# EAGLE design 0 (EAGLE 7.6.0)
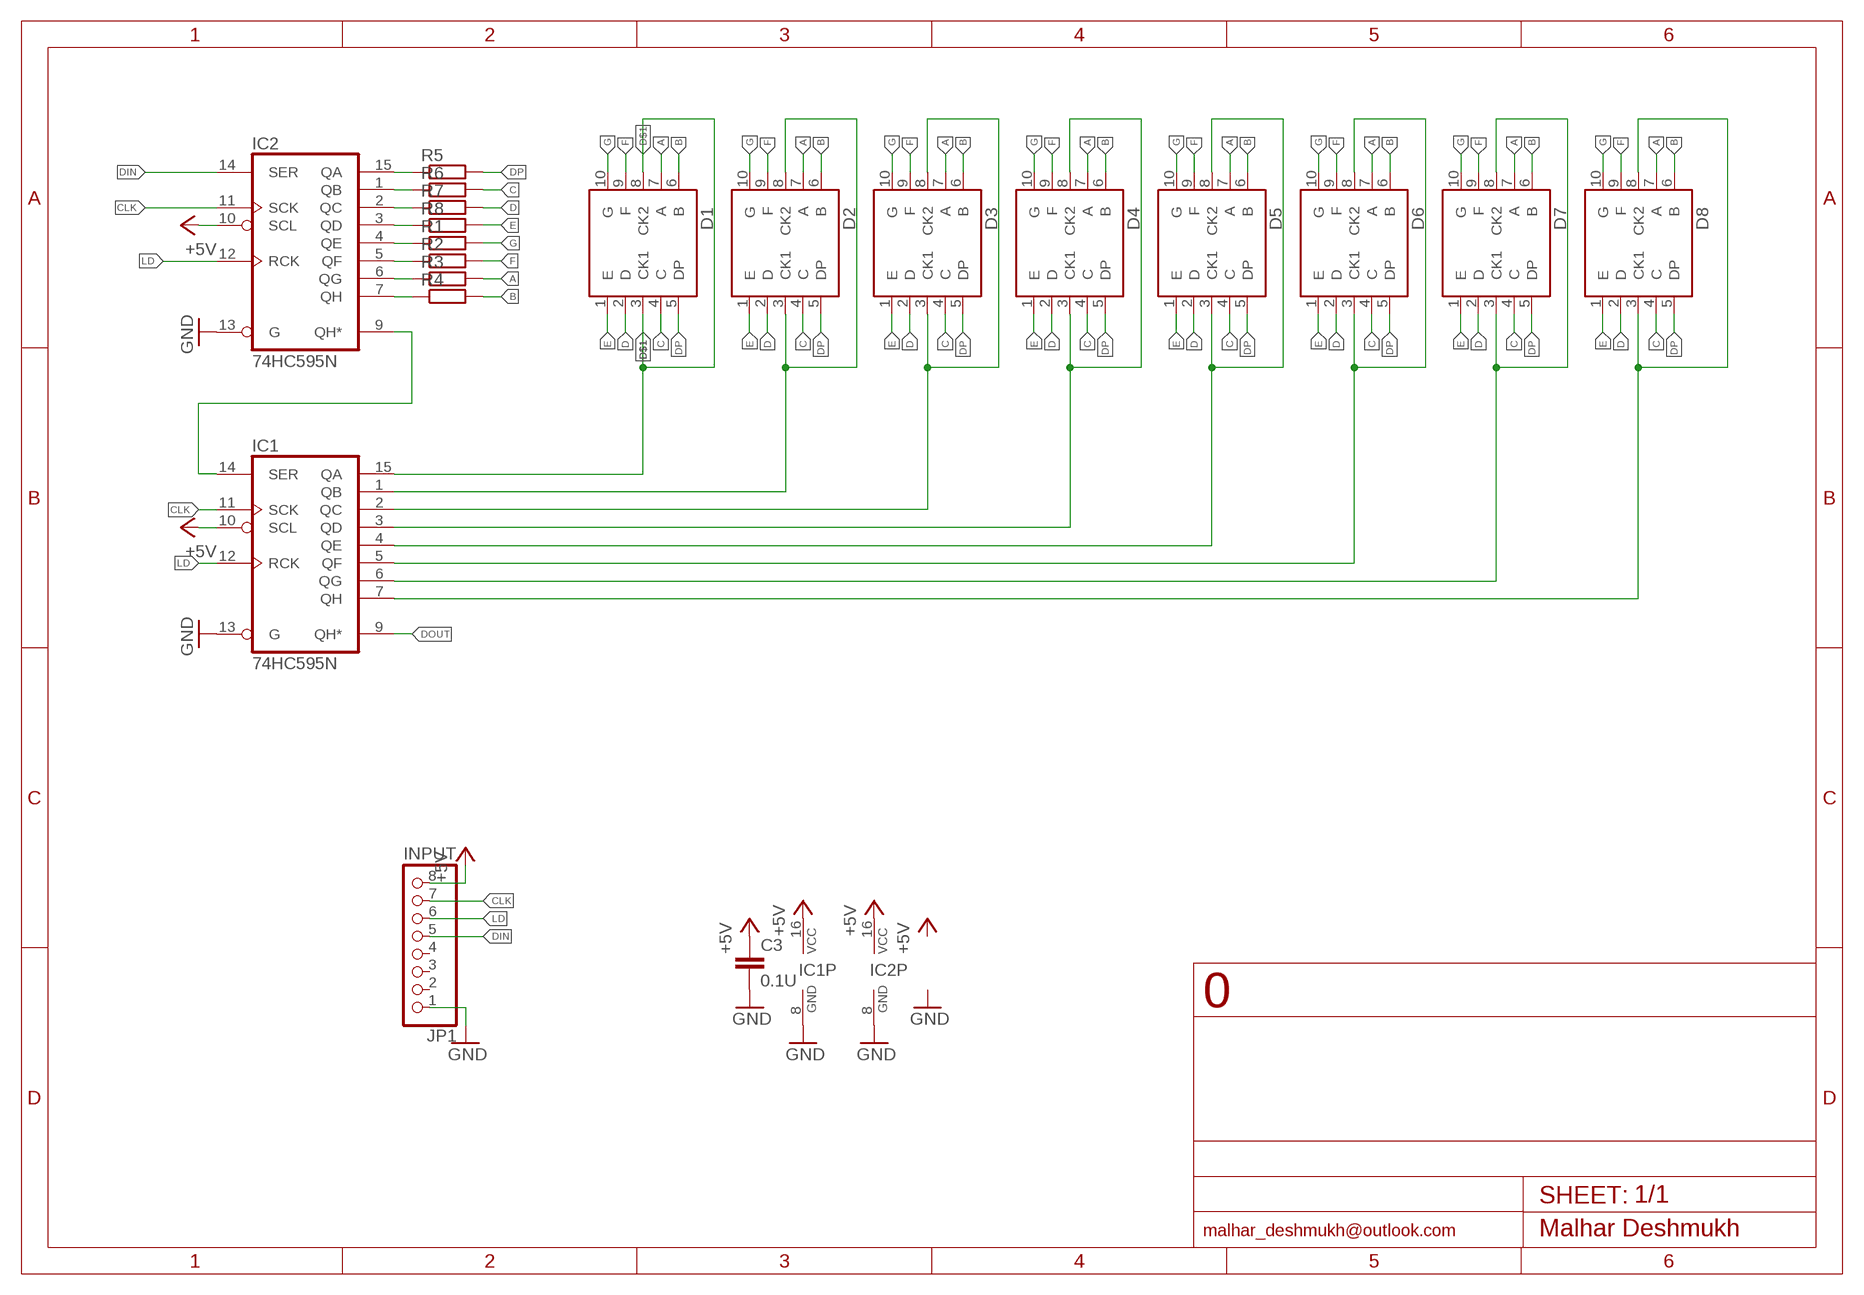
[diagram p0: schematic, sheet 1]

## Parts
C3  0.1U  C-EU050-024X044  [C050-024X044]
D1  7SEG-CK  [7SEG-13]
D2  7SEG-CK  [7SEG-13]
D3  7SEG-CK  [7SEG-13]
D4  7SEG-CK  [7SEG-13]
D5  7SEG-CK  [7SEG-13]
D6  7SEG-CK  [7SEG-13]
D7  7SEG-CK  [7SEG-13]
D8  7SEG-CK  [7SEG-13]
IC1  74HC595N  [DIL16]
IC2  74HC595N  [DIL16]
JP1  INPUT  PINHD-1X8  [1X08]
R1  R-EU_0207/7  [0207/7]
R2  R-EU_0207/7  [0207/7]
R3  R-EU_0207/7  [0207/7]
R4  R-EU_0207/7  [0207/7]
R5  R-EU_0207/7  [0207/7]
R6  R-EU_0207/7  [0207/7]
R7  R-EU_0207/7  [0207/7]
R8  R-EU_0207/7  [0207/7]

## Nets
+5V: C3.1 IC1.10(SCL) IC1.16(VCC) IC2.10(SCL) IC2.16(VCC) JP1.8
A: D1.7(A) D2.7(A) D3.7(A) D4.7(A) D5.7(A) D6.7(A) D7.7(A) D8.7(A) R3.2
B: D1.6(B) D2.6(B) D3.6(B) D4.6(B) D5.6(B) D6.6(B) D7.6(B) D8.6(B) R4.2
C: D1.4(C) D2.4(C) D3.4(C) D4.4(C) D5.4(C) D6.4(C) D7.4(C) D8.4(C) R6.2
CLK: IC1.11(SCK) IC2.11(SCK) JP1.7
D: D1.2(D) D2.2(D) D3.2(D) D4.2(D) D5.2(D) D6.2(D) D7.2(D) D8.2(D) R7.2
D$1: D1.3(CK1) D1.8(CK2) IC1.15(QA)
DIN: IC2.14(SER) JP1.5
DOUT: IC1.9(QH*)
DP: D1.5(DP) D2.5(DP) D3.5(DP) D4.5(DP) D5.5(DP) D6.5(DP) D7.5(DP) D8.5(DP) R5.2
E: D1.1(E) D2.1(E) D3.1(E) D4.1(E) D5.1(E) D6.1(E) D7.1(E) D8.1(E) R8.2
F: D1.9(F) D2.9(F) D3.9(F) D4.9(F) D5.9(F) D6.9(F) D7.9(F) D8.9(F) R2.2
G: D1.10(G) D2.10(G) D3.10(G) D4.10(G) D5.10(G) D6.10(G) D7.10(G) D8.10(G) R1.2
GND: C3.2 IC1.8(GND) IC1.13(G) IC2.8(GND) IC2.13(G) JP1.1
LD: IC1.12(RCK) IC2.12(RCK) JP1.6
N$1: IC2.15(QA) R5.1
N$2: IC2.1(QB) R6.1
N$3: IC2.2(QC) R7.1
N$4: IC2.3(QD) R8.1
N$5: IC2.4(QE) R1.1
N$6: IC2.5(QF) R2.1
N$7: IC2.6(QG) R3.1
N$8: IC2.7(QH) R4.1
N$9: IC1.14(SER) IC2.9(QH*)
N$10: D2.3(CK1) D2.8(CK2) IC1.1(QB)
N$12: D3.3(CK1) D3.8(CK2) IC1.2(QC)
N$13: D5.3(CK1) D5.8(CK2) IC1.4(QE)
N$14: D6.3(CK1) D6.8(CK2) IC1.5(QF)
N$15: D7.3(CK1) D7.8(CK2) IC1.6(QG)
N$16: D8.3(CK1) D8.8(CK2) IC1.7(QH)
N$21: D4.3(CK1) D4.8(CK2) IC1.3(QD)
Unconnected: JP1.2 JP1.3 JP1.4

## Library data of the parts
C3 = CustomLib:C-EU: CAPACITOR, European symbol
D1-D8 = CustomLib:7SEG-CK: 7-segment DISPLAY single cathode, 13 mm
IC1 IC2 = 74xx-eu:74*595: 8-bit SHIFT REGISTER, output latch
JP1 = pinhead:PINHD-1X8: PIN HEADER
R1-R8 = CustomLib:R-EU_: RESISTOR, European symbol

## Board
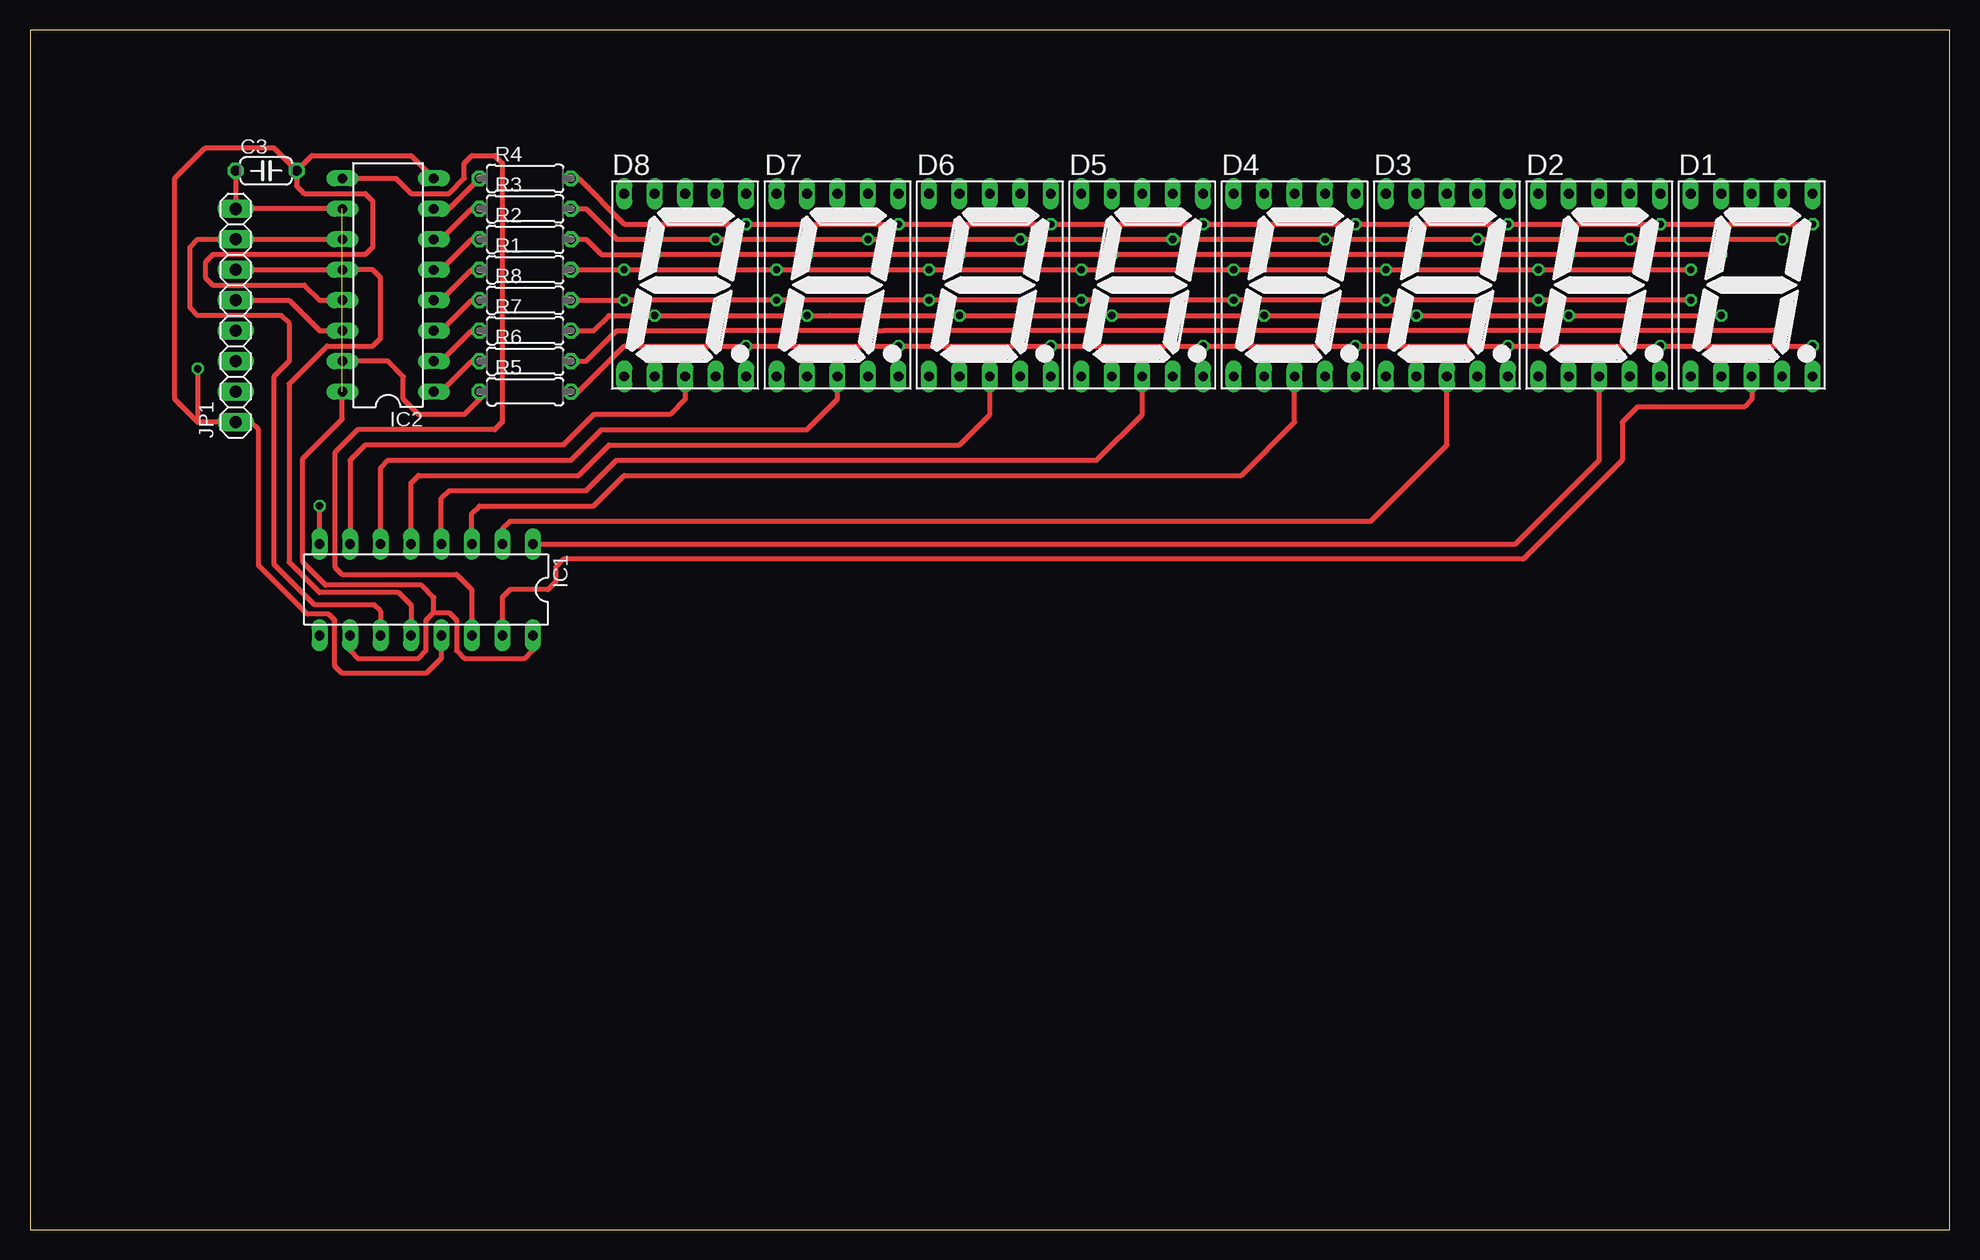
[diagram p1: board, top side]
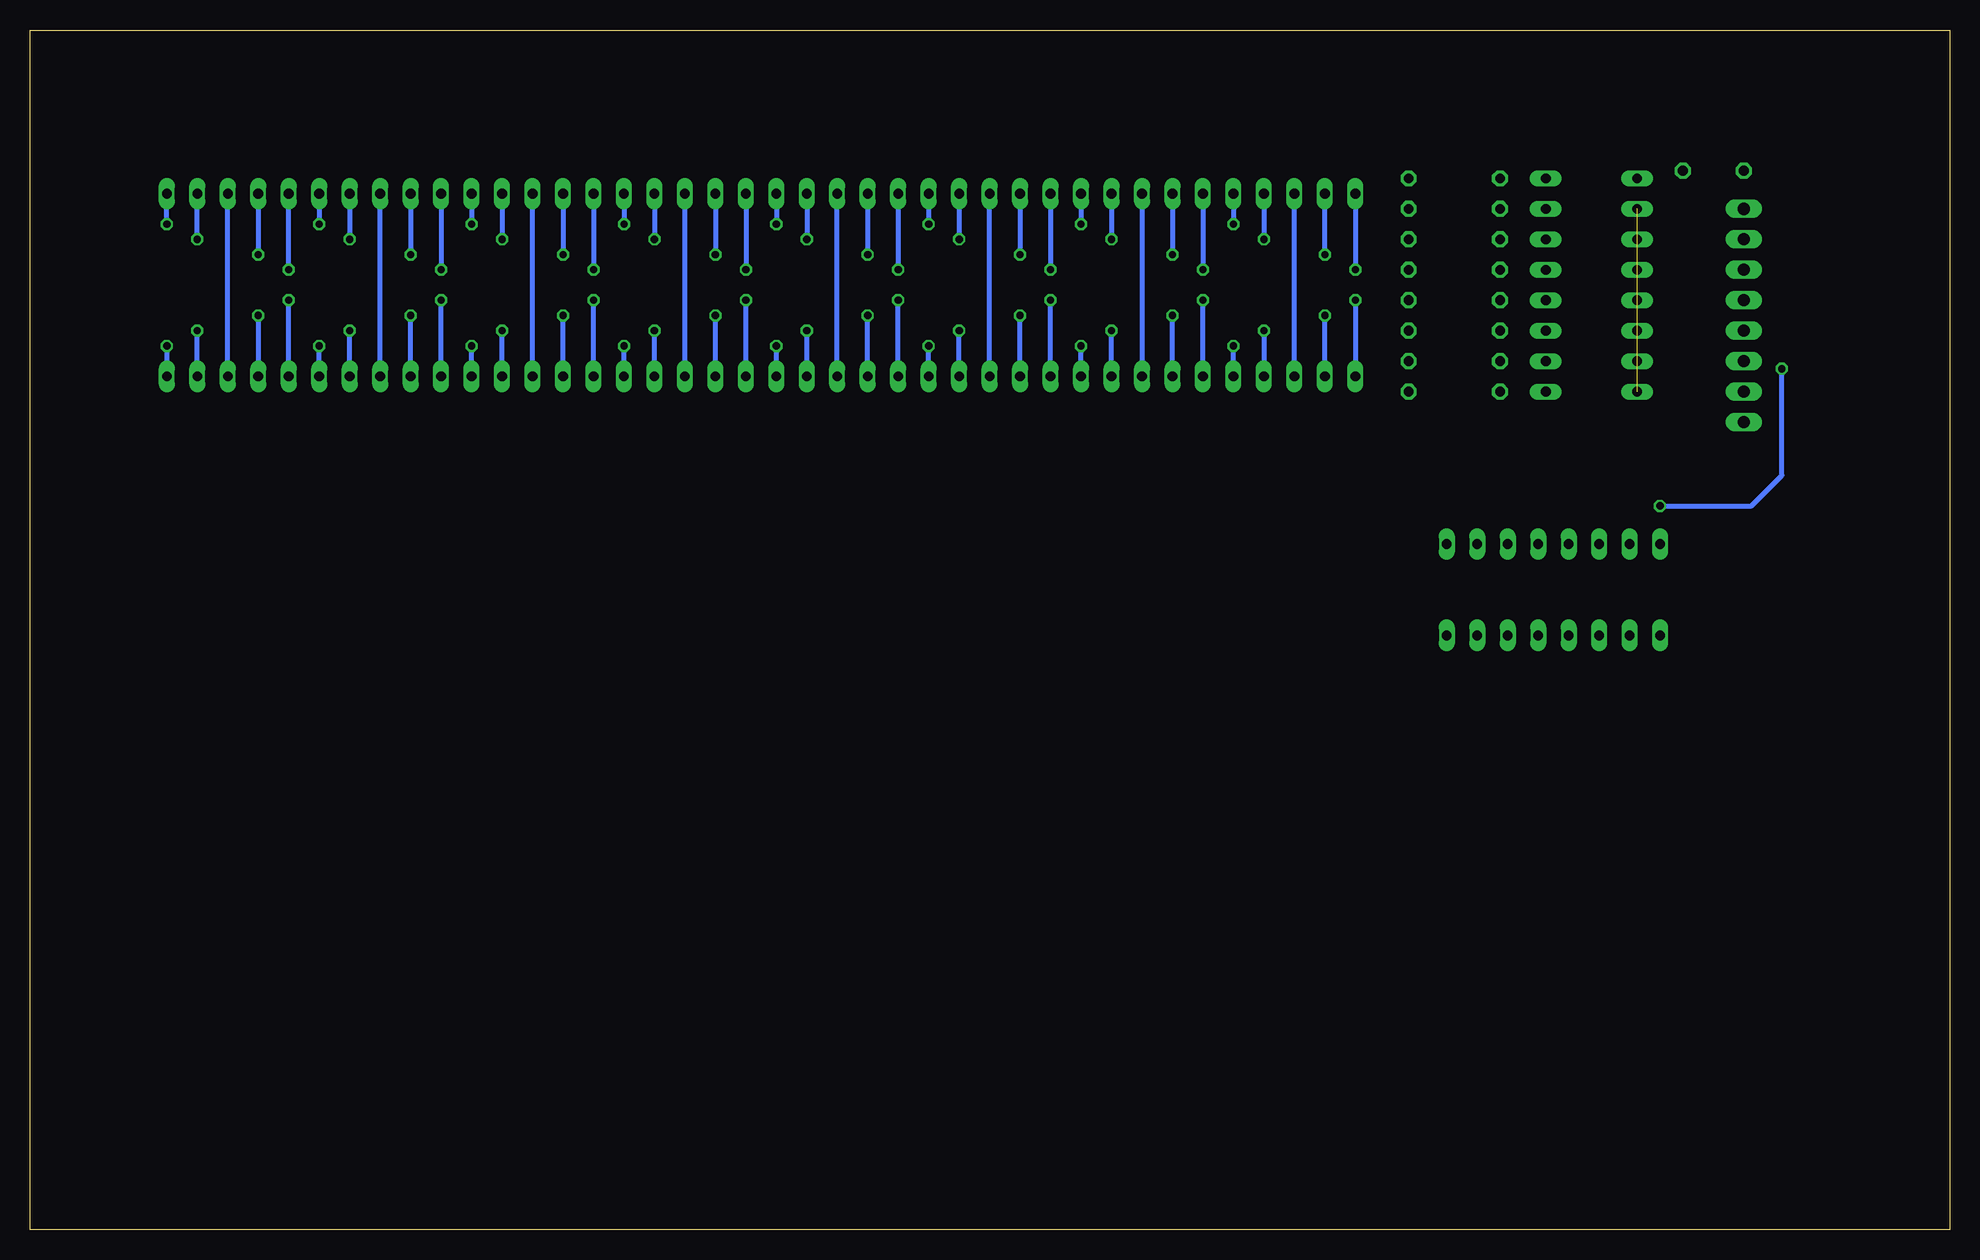
[diagram p2: board, bottom side, seen from below]

Size 160 x 100 mm. Coordinates in mm from the lower left corner, seen from the top.
Outline: 0,0 160,0 160,100 0,100 0,0
Copper layers (1*16): Top 0.035mm / dielectric 1.5mm / Bottom 0.035mm
Design rules "default": minimum track width 10mil, minimum drill 24mil, track to track 8mil, track to pad 8mil, pad to pad 8mil, via to via 8mil, smd to smd 8mil, copper to edge 40mil, drill to drill 8mil, minimum pad ring 10mil, minimum via ring 8mil, stop-mask expansion 4mil, vias tented up to drill 0mil, thermal gap 10mil

### Footprints (pad centres in the part's own frame; a part is rotated, then mirrored left to right if it is on the bottom)
C050-024X044 = drill 0.813 octagon: 1 -2.54,0; 2 2.54,0
7SEG-13 = drill 0.813 long: 1 -5.08,-7.62; 2 -2.54,-7.62; 3 0,-7.62; 4 2.54,-7.62; 5 5.08,-7.62; 6 5.08,7.62; 7 2.54,7.62; 8 0,7.62; 9 -2.54,7.62; 10 -5.08,7.62
DIL16 = drill 0.813 long: 1 -8.89,-3.81; 2 -6.35,-3.81; 3 -3.81,-3.81; 4 -1.27,-3.81; 5 1.27,-3.81; 6 3.81,-3.81; 7 6.35,-3.81; 8 8.89,-3.81; 9 8.89,3.81; 10 6.35,3.81; 11 3.81,3.81; 12 1.27,3.81; 13 -1.27,3.81; 14 -3.81,3.81; 15 -6.35,3.81; 16 -8.89,3.81
1X08 = drill 1.016 long: 1 -8.89,0; 2 -6.35,0; 3 -3.81,0; 4 -1.27,0; 5 1.27,0; 6 3.81,0; 7 6.35,0; 8 8.89,0
0207/7 = drill 0.813 octagon: 1 -3.81,0; 2 3.81,0

### Placement (x,y rotation side)
C3  19.68,88.27 0 top
D1  143.51,78.74 0 top
D2  130.81,78.74 0 top
D3  118.11,78.74 0 top
D4  105.41,78.74 0 top
D5  92.71,78.74 0 top
D6  80.01,78.74 0 top
D7  67.31,78.74 0 top
D8  54.61,78.74 0 top
IC1  33.02,53.34 180 top
IC2  29.84,78.74 90 top
JP1  17.14,76.2 90 top
R1  41.27,80.01 0 top
R2  41.27,82.55 0 top
R3  41.27,85.09 0 top
R4  41.27,87.63 0 top
R5  41.27,69.85 0 top
R6  41.27,72.39 0 top
R7  41.27,74.93 0 top
R8  41.27,77.47 0 top

### Tracks (layer width: path | path; a pad name or v marks a point on that pad's centre or on a via)
+5V  (1 unrouted)
  Top 0.406: IC2.10 JP1.8 C3.1 | IC1.10 26.67,48.26 27.3,47.62 32.38,47.62 33.02,48.26 33.02,50.8 33.66,51.44 | 33.66,51.44 34.92,51.44 35.56,50.8 35.56,48.26 36.2,47.62 41.27,47.62 41.91,48.26 IC1.16 | 33.66,51.44 33.66,52.7 32.64,53.72 24.64,53.72 22.73,55.63 22.73,64.26 26.04,67.56 IC2.16
A  (via drill 0.6 pad 0.81)
  Top 0.406: v146.05,82.55 v133.35,82.55 v120.65,82.55 v107.95,82.55 v95.25,82.55 v82.55,82.55 v69.85,82.55 v57.15,82.55 48.9,82.55 46.35,85.09 R3.2
  Bottom 0.406: D8.7 v57.15,82.55 | v146.05,82.55 D1.7 | D7.7 v69.85,82.55 | D6.7 v82.55,82.55 | D5.7 v95.25,82.55 | D4.7 v107.95,82.55 | D3.7 v120.65,82.55 | D2.7 v133.35,82.55
B  (via drill 0.6, 0.6 pad 0.81)
  Top 0.406: v148.59,83.82 v135.89,83.82 v123.19,83.82 v110.49,83.82 v97.79,83.82 v85.09,83.82 v72.39,83.82 v59.69,83.82 49.53,83.82 45.72,87.63 R4.2
  Bottom 0.406: D8.6 v59.69,83.82 | v148.59,83.82 D1.6 | D7.6 v72.39,83.82 | D6.6 v85.09,83.82 | D5.6 v97.79,83.82 | D4.6 v110.49,83.82 | D3.6 v123.19,83.82 | D2.6 v135.89,83.82
C  (via drill 0.6 pad 0.81)
  Top 0.406: v146.05,74.93 v133.35,74.93 v120.65,74.93 v107.95,74.93 v95.25,74.93 v82.55,74.93 71.12,74.93 v69.85,74.93 v57.15,74.93 48.9,74.93 46.35,72.39 R6.2
  Bottom 0.406: D1.4 v146.05,74.93 | v57.15,74.93 D8.4 | D7.4 v69.85,74.93 | D6.4 v82.55,74.93 | D5.4 v95.25,74.93 | D4.4 v107.95,74.93 | D3.4 v120.65,74.93 | D2.4 v133.35,74.93
CLK
  Top 0.406: IC2.11 JP1.7 13.97,82.55 13.34,81.92 13.34,76.83 13.97,76.2 20.95,76.2 21.59,75.56 21.59,72.39 20.32,71.12 20.32,55.5 23.75,52.07 28.7,52.07 29.21,51.56 IC1.11
D  (via drill 0.6 pad 0.81)
  Top 0.406: v140.97,76.2 v128.27,76.2 v115.57,76.2 v102.87,76.2 v90.17,76.2 v77.47,76.2 66.67,76.2 v64.77,76.2 v52.07,76.2 48.26,76.2 46.99,74.93 R7.2
  Bottom 0.406: D8.2 v52.07,76.2 | v140.97,76.2 D1.2 | D7.2 v64.77,76.2 | D6.2 v77.47,76.2 | D5.2 v90.17,76.2 | D4.2 v102.87,76.2 | D3.2 v115.57,76.2 | D2.2 v128.27,76.2
D$1
  Top 0.406: D1.3 143.51,69.22 142.88,68.58 133.99,68.58 132.72,67.31 132.72,64.14 124.46,55.88 44.45,55.88 43.81,55.24 43.81,53.98 43.18,53.34 40.01,53.34 39.37,52.7 IC1.15
  Bottom 0.406: D1.3 D1.8
DIN
  Top 0.406: JP1.5 21.59,77.47 24.13,74.93 IC2.14
DP  (via drill 0.6 pad 0.81)
  Top 0.406: v148.59,73.66 v135.89,73.66 v123.19,73.66 v110.49,73.66 v97.79,73.66 v85.09,73.66 73.03,73.66 v72.39,73.66 v59.69,73.66 49.53,73.66 45.72,69.85 R5.2
  Bottom 0.406: D8.5 v59.69,73.66 | v148.59,73.66 D1.5 | D7.5 v72.39,73.66 | D6.5 v85.09,73.66 | D5.5 v97.79,73.66 | D4.5 v110.49,73.66 | D3.5 v123.19,73.66 | D2.5 v135.89,73.66
E  (via drill 0.6 pad 0.81)
  Top 0.406: v138.43,77.47 v125.73,77.47 v113.03,77.47 v100.33,77.47 v87.63,77.47 v74.93,77.47 v62.23,77.47 v49.53,77.47 R8.2
  Bottom 0.406: D1.1 v138.43,77.47 | v49.53,77.47 D8.1 | D7.1 v62.23,77.47 | D6.1 v74.93,77.47 | D5.1 v87.63,77.47 | D4.1 v100.33,77.47 | D3.1 v113.03,77.47 | D2.1 v125.73,77.47
F  (via drill 0.6 pad 0.81)
  Top 0.406: v140.97,81.28 v128.27,81.28 v115.57,81.28 v102.87,81.28 v90.17,81.28 v77.47,81.28 v64.77,81.28 v52.07,81.28 47.62,81.28 46.35,82.55 R2.2
  Bottom 0.406: D1.9 v140.97,81.28 | v52.07,81.28 D8.9 | D7.9 v64.77,81.28 | D6.9 v77.47,81.28 | D5.9 v90.17,81.28 | D4.9 v102.87,81.28 | D3.9 v115.57,81.28 | D2.9 v128.27,81.28
G  (via drill 0.6 pad 0.81)
  Top 0.406: v138.43,80.01 v125.73,80.01 v113.03,80.01 v100.33,80.01 v87.63,80.01 v74.93,80.01 v62.23,80.01 v49.53,80.01 R1.2
  Bottom 0.406: D8.10 v49.53,80.01 | v138.43,80.01 D1.10 | D7.10 v62.23,80.01 | D6.10 v74.93,80.01 | D5.10 v87.63,80.01 | D4.10 v100.33,80.01 | D3.10 v113.03,80.01 | D2.10 v125.73,80.01
GND  (via drill 0.6 pad 0.81)
  Top 0.406: C3.2 23.5,89.53 31.75,89.53 IC2.8 | C3.2 22.23,87 22.86,86.36 27.94,86.36 28.57,85.72 28.57,81.92 27.94,81.28 15.24,81.28 14.61,80.64 14.61,79.38 15.24,78.74 22.86,78.74 24.13,77.47 IC2.13 | IC1.13 34.29,47.62 33.02,46.35 26.04,46.35 25.4,46.99 25.4,50.8 24.89,51.31 23.11,51.31 19.05,55.37 19.05,66.67 18.41,67.31 JP1.1 13.97,67.31 | 13.97,67.31 12.06,69.22 12.06,87.63 14.61,90.17 20.32,90.17 C3.2 | IC1.8 v24.13,60.33 | v13.97,71.75 13.97,67.31
  Bottom 0.406: v24.13,60.33 16.51,60.33 13.97,62.87 v13.97,71.75
LD
  Top 0.406: JP1.6 IC2.12 28.57,80.01 29.21,79.38 29.21,74.3 28.57,73.66 24.77,73.66 21.59,70.48 21.59,55.63 24.13,53.09 30.73,53.09 31.75,52.07 IC1.12
N$1
  Top 0.406: R5.1 37.47,69.22 36.2,67.94 32.38,67.94 31.11,69.22 31.11,71.12 29.84,72.39 IC2.15
N$2
  Top 0.406: IC2.1 34.29,69.85 36.83,72.39 R6.1
N$3
  Top 0.406: IC2.2 34.29,72.39 36.83,74.93 R7.1
N$4
  Top 0.406: IC2.3 34.29,74.93 36.83,77.47 R8.1
N$5
  Top 0.406: IC2.4 34.29,77.47 36.83,80.01 R1.1
N$6
  Top 0.406: IC2.5 34.29,80.01 36.83,82.55 R2.1
N$7
  Top 0.406: IC2.6 34.29,82.55 36.83,85.09 R3.1
N$8
  Top 0.406: IC2.7 34.92,85.09 R4.1
N$9
  Top 0.406: IC2.9 30.48,87.63 31.75,86.36 34.92,86.36 36.2,87.63 36.2,88.9 36.83,89.53 38.73,89.53 39.37,88.9 39.37,67.31 38.73,66.67 27.3,66.67 25.4,64.77 25.4,55.24 26.04,54.61 35.56,54.61 36.83,53.34 IC1.14
N$10
  Top 0.406: IC1.1 123.83,57.15 130.81,64.14 D2.3
  Bottom 0.406: D2.3 D2.8
N$12
  Top 0.406: IC1.2 39.37,58.42 40.01,59.05 111.76,59.05 118.11,65.41 D3.3
  Bottom 0.406: D3.3 D3.8
N$13
  Top 0.406: IC1.4 34.29,60.96 34.92,61.59 46.35,61.59 48.9,64.14 88.9,64.14 92.71,67.94 D5.3
  Bottom 0.406: D5.3 D5.8
N$14
  Top 0.406: IC1.5 31.75,62.23 32.38,62.87 45.72,62.87 48.26,65.41 77.47,65.41 80.01,67.94 D6.3
  Bottom 0.406: D6.3 D6.8
N$15
  Top 0.406: IC1.6 29.21,63.5 29.84,64.14 45.09,64.14 47.62,66.67 64.77,66.67 67.31,69.22 D7.3
  Bottom 0.406: D7.8 D7.3
N$16
  Top 0.406: D8.3 54.61,69.22 53.34,67.94 46.99,67.94 44.45,65.41 27.94,65.41 26.67,64.14 IC1.7
  Bottom 0.406: D8.3 D8.8
N$21
  Top 0.406: IC1.3 36.83,59.69 37.47,60.33 46.99,60.33 49.53,62.87 100.97,62.87 105.41,67.31 D4.3
  Bottom 0.406: D4.3 D4.8